# EAGLE schematic LM4811 Audio Amp (EAGLE 9.2.2)
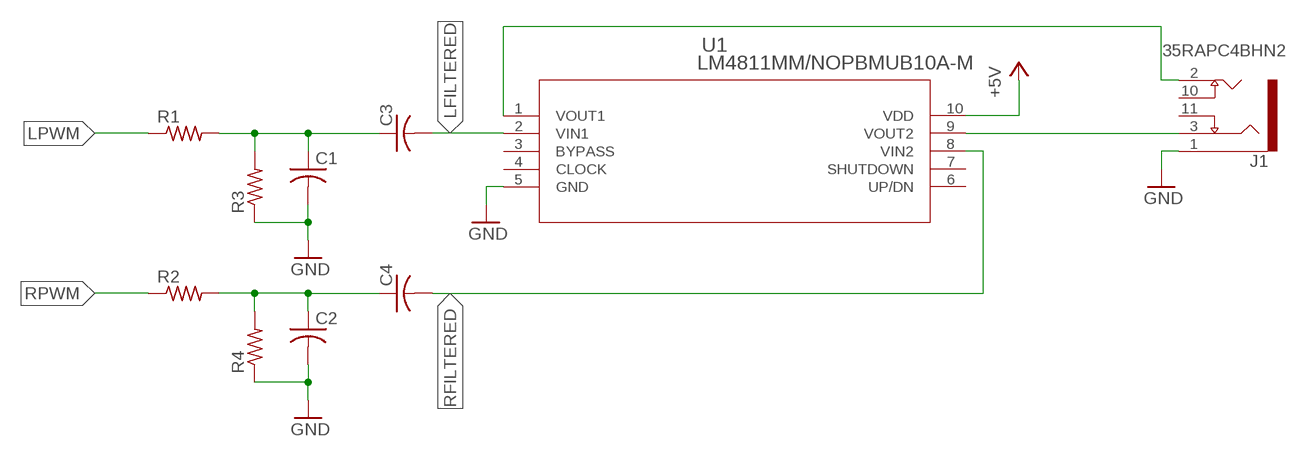
[diagram p0: schematic, sheet 1]

## Parts
C1  C-USC0805K  [C0805K]
C2  C-USC0805K  [C0805K]
C3  C-USC0805K  [C0805K]
C4  C-USC0805K  [C0805K]
J1  35RAPC4BHN2  [SWITCHCRAFT_35RAPC4BHN2]
R1  R-US_R0805  [R0805]
R2  R-US_R0805  [R0805]
R3  R-US_R0805  [R0805]
R4  R-US_R0805  [R0805]
U1  LM4811MM/NOPBMUB10A-M  [MUB10A-M]

## Nets
+5V: U1.10(VDD)
GND: C1.2 C2.2 J1.1 R3.1 R4.1 U1.5(GND)
LFILTERED: C3.2 U1.2(VIN1)
LPWM: R1.1
N$1: C1.1 C3.1 R1.2 R3.2
N$2: C2.1 C4.1 R2.2 R4.2
N$3: J1.2 U1.1(VOUT1)
N$4: J1.3 U1.9(VOUT2)
RFILTERED: C4.2 U1.8(VIN2)
RPWM: R2.1
Unconnected: J1.10 J1.11 U1.3(BYPASS) U1.4(CLOCK) U1.6(UP/DN) U1.7(SHUTDOWN)

## Library data of the parts
C1-C4 = rcl:C-US: CAPACITOR, American symbol; SPICEPREFIX: C
J1 = 35RAPC4BHN2:35RAPC4BHN2: Conn 3.5MM Stereo Jack F 5 POS Solder RA Thru-Hole 5 Terminal 1 Port; DESCRIPTION: Conn 3.5MM Stereo Jack F 5 POS Solder RA Thru-Hole 5 Terminal 1 Port; DIGI-KEY_PART_NUMBER: SC1459-ND; DIGI-KEY_PURCHASE_URL: https://www.digikey.com/product-detail/en/switchcraft-inc/35RAPC4BHN2/SC1459-ND/1288690?utm_source=snapeda&utm_medium=aggregator&utm_campaign=symbol; MF: Switchcraft; MP: 35RAPC4BHN2; PACKAGE: None
R1-R4 = rcl:R-US_: RESISTOR, American symbol; SPICEPREFIX: R
U1 = LM4811MM:LM4811MM/NOPB: Audio Amp AB 2-Channel DigitalVolume; MANUFACTURER_PART_NUMBER: LM4811MMNOPB; VENDOR: Texas Instruments